# Altium project 006_ARDUNIO.PrjPcb
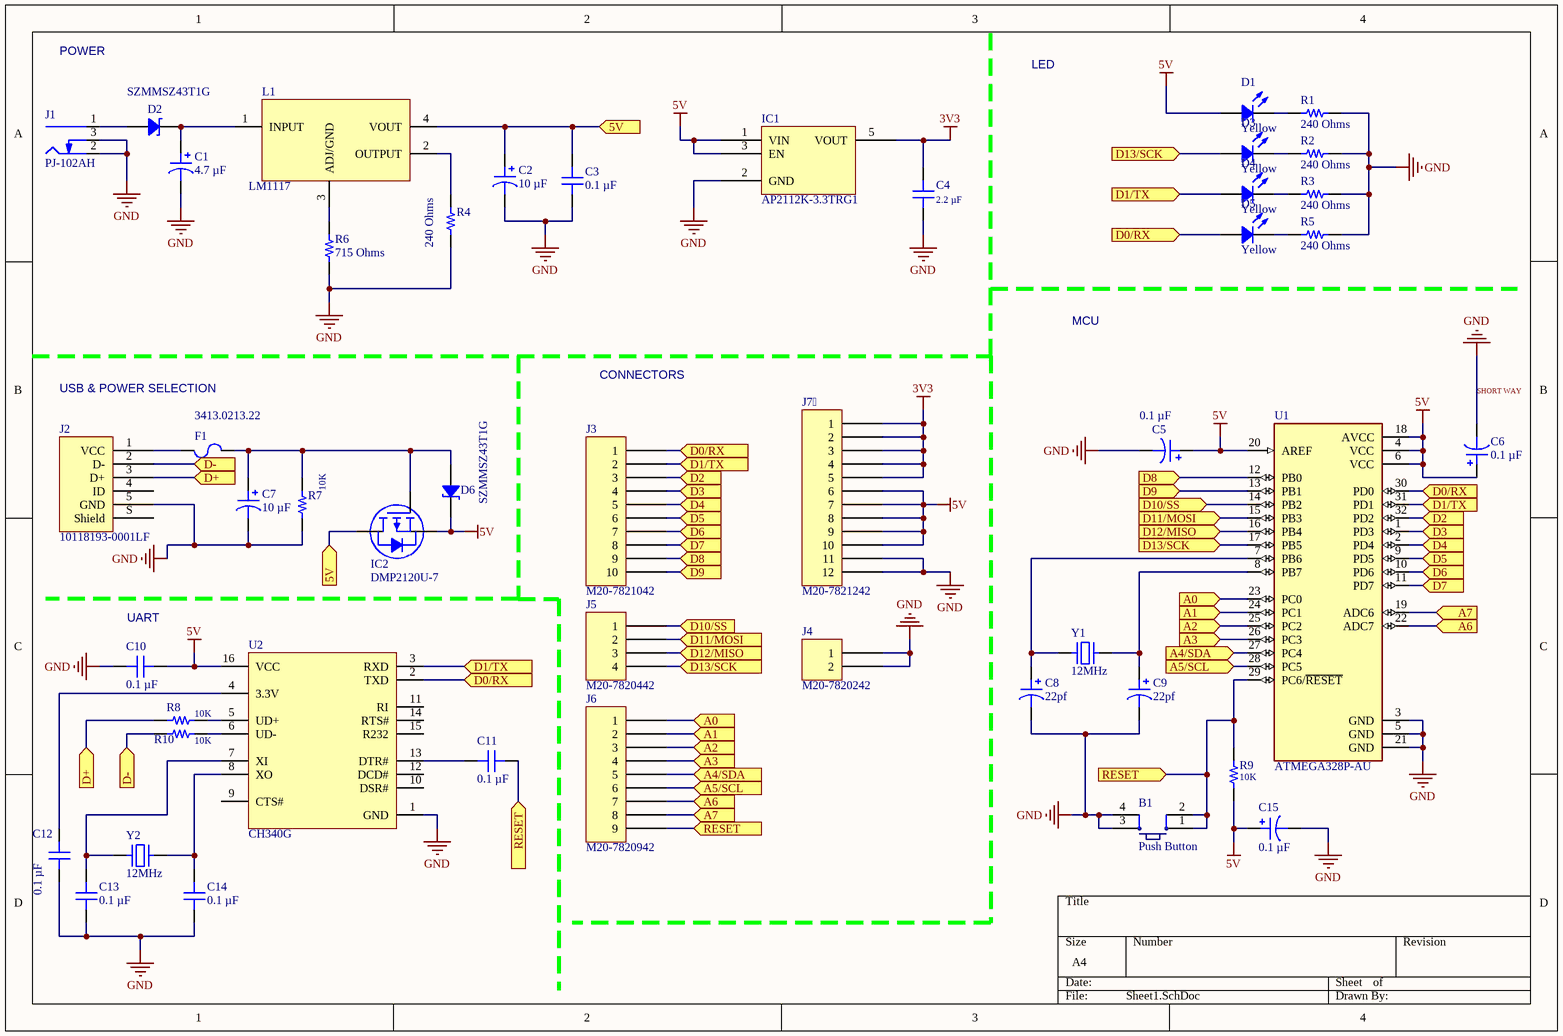
[diagram p0: Sheet1.SchDoc]
1 sheet, 47 parts. Net scope: flat (ports and power ports of the same name join across sheets).
Board file: PCB1.PcbDoc

## Sheet Sheet1.SchDoc
size A4; SheetNumber: 1; SheetTotal: 1

### Parts
B1  Push Button  [PUSB BUTTON-SMD]
C1  4.7 µF  [CAP POL 1206_3216]
C2  10 µF  [CAP POL 1206_3216]
C3  0.1 µF  [CAP 0805_2012]
C4  2.2 µF  [CAP 0805_2012]
C5  0.1 µF  [CAP POL 1206_3216]
C6  0.1 µF  [CAP POL 1206_3216]
C7  10 µF  [CAP POL 1206_3216]
C8  22pf  [CAP POL 1206_3216]
C9  22pf  [CAP POL 1206_3216]
C10  0.1 µF  [CAP 0805_2012]
C11  0.1 µF  [CAP 0805_2012]
C12  0.1 µF  [CAP 0805_2012]
C13  0.1 µF  [CAP 0805_2012]
C14  0.1 µF  [CAP 0805_2012]
C15  0.1 µF  [CAP POL 1206_3216]
D1  Yellow  [LED 0805_2012 YELLOW]
D2  SZMMSZ43T1G  [SOD-123]
D3  Yellow  [LED 0805_2012 YELLOW]
D4  Yellow  [LED 0805_2012 YELLOW]
D5  Yellow  [LED 0805_2012 YELLOW]
D6  SZMMSZ43T1G  [SOD-123]
F1  3413.0213.22  [FUSE 1206_3216 0.6MM]
IC1  AP2112K-3.3TRG1  [DIODES SOT-23-5 W5]
IC2  DMP2120U-7  [DIODES SOT-23-3]
J1  PJ-102AH  [CUI PJ-102AH]
J2  10118193-0001LF  [FCI USB 10118193-0001LF]
J3  M20-7821042  [HARWIN M20-7821045]
J4  M20-7820242  [HARWIN M20-7820245]
J5  M20-7820442  [HARWIN M20-7820445]
J6  M20-7820942  [HARWIN M20-7820945]
J7  M20-7821242  [HARWIN M20-7821245]
L1  LM1117  [LM1117_SOT230P700X180-4N]
R1  240 Ohms  [RES 0805_2012]
R2  240 Ohms  [RES 0805_2012]
R3  240 Ohms  [RES 0805_2012]
R4  240 Ohms  [RES 0805_2012]
R5  240 Ohms  [RES 0805_2012]
R6  715 Ohms  [RES 0805_2012]
R7  10K  [RES 0805_2012]
R8  10K  [RES 0805_2012]
R9  10K  [RES 0805_2012]
R10  10K  [RES 0805_2012]
U1  ATMEGA328P-AU  [QFP80P900X900X120-32N]
U2  CH340G  [CH340G]
Y1  12MHz  [TXC 9C]
Y2  12MHz  [TXC 9C]

### Ports
5V (in, see Sheet1[1C]), 5V (in, see Sheet1[2A]), A0 (in, see Sheet1[2C]), A0 (in, see Sheet1[4C]), A1 (in, see Sheet1[2C]), A1 (in, see Sheet1[4C]), A2 (in, see Sheet1[2C]), A2 (in, see Sheet1[4C]), A3 (in, see Sheet1[2C]), A3 (in, see Sheet1[4C]), A4/SDA (in, see Sheet1[2D]), A4/SDA (in, see Sheet1[3C]), A5/SCL (in, see Sheet1[2D]), A5/SCL (in, see Sheet1[3C]), A6 (in, see Sheet1[2D]), A6 (in, see Sheet1[4C]), A7 (in, see Sheet1[2D]), A7 (in, see Sheet1[4C]), D0/RX (in, see Sheet1[2B], Sheet1[2C], Sheet1[3A]), D0/RX (in, see Sheet1[2B], Sheet1[2C], Sheet1[4B]), D0/RX (in, see Sheet1[2B], Sheet1[3A], Sheet1[4B]), D0/RX (in, see Sheet1[2C], Sheet1[3A], Sheet1[4B]), D1/TX (in, see Sheet1[2B], Sheet1[2C], Sheet1[3A]), D1/TX (in, see Sheet1[2B], Sheet1[2C], Sheet1[4B]), D1/TX (in, see Sheet1[2B], Sheet1[3A], Sheet1[4B]), D1/TX (in, see Sheet1[2C], Sheet1[3A], Sheet1[4B]), D2 (in, see Sheet1[2B]), D2 (in, see Sheet1[4C]), D3 (in, see Sheet1[2B]), D3 (in, see Sheet1[4C]), D4 (in, see Sheet1[2B]), D4 (in, see Sheet1[4C]), D5 (in, see Sheet1[2C]), D5 (in, see Sheet1[4C]), D6 (in, see Sheet1[2C]), D6 (in, see Sheet1[4C]), D7 (in, see Sheet1[2C]), D7 (in, see Sheet1[4C]), D8 (in, see Sheet1[2C]), D8 (in, see Sheet1[3B]), D9 (in, see Sheet1[2C]), D9 (in, see Sheet1[3B]), D10/SS (in, see Sheet1[2C]), D10/SS (in, see Sheet1[3B]), D11/MOSI (in, see Sheet1[2C]), D11/MOSI (in, see Sheet1[3C]), D12/MISO (in, see Sheet1[2C]), D12/MISO (in, see Sheet1[3C]), D13/SCK (in, see Sheet1[2C], Sheet1[3A]), D13/SCK (in, see Sheet1[2C], Sheet1[3C]), D13/SCK (in, see Sheet1[3A], Sheet1[3C]), D+ (in, see Sheet1[1B]), D+ (in, see Sheet1[1D]), D- (in, see Sheet1[1B]), D- (in, see Sheet1[1D]), RESET (in, see Sheet1[2D]), RESET (in, see Sheet1[2D], Sheet1[3D])

### Nets
3V3: C4.2 IC1.5(VOUT) J7.1 J7.2 J7.3 J7.4 J7.5
5V: C5.1 C6.1 C10.1 C15.1 D1.1 D6.2 IC1.1(VIN) IC1.3(EN) IC2.2(S) J7.6 J7.7 J7.8 J7.9 J7.10 R9.2 U1.4(VCC) U1.6(VCC) U1.18(AVCC) U1.20(AREF) U2.16(VCC)
SHORT WAY: B1.3 B1.4 C1.2 C2.2 C3.1 C4.1 C5.2 C6.2 C7.2 C8.2 C9.2 C10.2 C12.1 C13.2 C14.2 C15.2 IC1.2(GND) J1.2(Outer) J1.3(SW) J2.5(GND) J4.1 J4.2 J7.11 J7.12 R1.1 R2.1 R3.1 R4.1 R5.1 R6.1 R7.1 U1.3(GND) U1.5(GND) U1.21(GND) U2.1(GND)  [also labelled GND]
NetB1_1: B1.1 B1.2 C11.1 J6.9 R9.1 U1.29(PC6/~{RESET}) ; port RESET
NetC1_1: C1.1 D2.2 L1.1(INPUT)
NetC2_1: C2.1 C3.2 IC2.3(D) L1.4(VOUT) ; port 5V
NetC7_1: C7.1 D6.1 F1.1 IC2.1(G) R7.2
NetC8_1: C8.1 U1.7(PB6) Y1.1
NetC9_1: C9.1 U1.8(PB7) Y1.2
NetC11_2: C11.2 U2.13(DTR#)
NetC12_2: C12.2 U2.4(3.3V)
NetC13_1: C13.1 U2.7(XI) Y2.1
NetC14_1: C14.1 U2.8(XO) Y2.2
NetD1_2: D1.2 R1.2
NetD2_1: D2.1 J1.1(Centre)
NetD3_1: D3.1 J5.4 U1.17(PB5) ; port D13/SCK
NetD3_2: D3.2 R2.2
NetD4_1: D4.1 J3.2 U1.31(PD1) U2.3(RXD) ; port D1/TX
NetD4_2: D4.2 R3.2
NetD5_1: D5.1 J3.1 U1.30(PD0) U2.2(TXD) ; port D0/RX
NetD5_2: D5.2 R5.2
NetF1_2: F1.2 J2.1(VCC)
NetJ2_2: J2.2(D-) R10.2 ; port D-
NetJ2_3: J2.3(D+) R8.2 ; port D+
NetJ3_3: J3.3 U1.32(PD2) ; port D2
NetJ3_4: J3.4 U1.1(PD3) ; port D3
NetJ3_5: J3.5 U1.2(PD4) ; port D4
NetJ3_6: J3.6 U1.9(PD5) ; port D5
NetJ3_7: J3.7 U1.10(PD6) ; port D6
NetJ3_8: J3.8 U1.11(PD7) ; port D7
NetJ3_9: J3.9 U1.12(PB0) ; port D8
NetJ3_10: J3.10 U1.13(PB1) ; port D9
NetJ5_1: J5.1 U1.14(PB2) ; port D10/SS
NetJ5_2: J5.2 U1.15(PB3) ; port D11/MOSI
NetJ5_3: J5.3 U1.16(PB4) ; port D12/MISO
NetJ6_1: J6.1 U1.23(PC0) ; port A0
NetJ6_2: J6.2 U1.24(PC1) ; port A1
NetJ6_3: J6.3 U1.25(PC2) ; port A2
NetJ6_4: J6.4 U1.26(PC3) ; port A3
NetJ6_5: J6.5 U1.27(PC4) ; port A4/SDA
NetJ6_6: J6.6 U1.28(PC5) ; port A5/SCL
NetJ6_7: J6.7 U1.22(ADC7) ; port A6
NetJ6_8: J6.8 U1.19(ADC6) ; port A7
NetL1_2: L1.2(OUTPUT) R4.2
NetL1_3: L1.3(ADJ/GND) R6.2
NetR8_1: R8.1 U2.5(UD+)
NetR10_1: R10.1 U2.6(UD-)

Not connected (* = marked no-connect by the designer): J2 4(ID) S(Shield); U2 9(CTS#) 10(DSR#) 11(RI) 12(DCD#) 14(RTS#) 15(R232)

### Notes on the sheet
- POWER
- LED
- CONNECTORS
- MCU
- USB & POWER SELECTION
- (near C10) UART

### Library data of the parts
B1 = Push Button: Smd Push Button; Satın Alma Linki: https://urun.n11.com/diger/mini-pushbutton-switch-smd-P227461537?gclid=Cj0KCQjwkoDmBRCcARIsAG3xzl8Y_-jeD7HocNM6lvuZ_rVp83568XPGtNzlPwXWLph8oCRqo0yh87UaApZYEALw_wcB&gclsrc=aw.ds
C1 C5 C6 C8 C9 C15 = T494A106K016AT: CAP TANT 10UF 10% 16V 1206; manufacturer: KEMET; Manufacturer Size Code: A; Capacitance: 10 µF; ESR (Equivalent Series Resistance): 3Ohm; Lifetime @ Temp.: 2000 Hrs @ 125°C; Type: Molded; Part Number: T494A106K016AT; componentlink1description: Datasheet; componentlink1url: https://api.kemet.com/component-edge/download/datasheet/T494A106K016AT.pdf; componentlink2description: DigiKey Link; componentlink2url: https://www.digikey.com/en/products/detail/kemet/T494A106K016AT/3724803; Device Package: 1206 (3216 Metric); Features: General Purpose; Height - Seated (Max): 0.071" (1.80mm); lastupdated: 9/19/2022 1:38:10 PM; Lifecycle Status: Active; Minimum Order: 1; Mounting Type: Surface Mount; Operating Temperature: -55°C ~ 125°C; Package / Case: 1206 (3216 Metric); packaging: TapeAndReel; partid: 171; Part Status: Active; price: 0.27; series: T494; Size / Dimension: 0.126" L x 0.063" W (3.20mm x 1.60mm); Supplier 1: DigiKey; Supplier Part Number 1: 399-9756-1-ND; Tolerance: ±10%; Voltage - Rated: 16 V
  C1: Value: 4.7 µF
  C5 C6 C15: Value: 0.1 µF
  C8 C9: Value: 22pf
C2 C7 = T494A106K016AT: CAP TANT 10UF 10% 16V 1206; manufacturer: KEMET; Manufacturer Size Code: A; ESR (Equivalent Series Resistance): 3Ohm; Lifetime @ Temp.: 2000 Hrs @ 125°C; Type: Molded; Part Number: T494A106K016AT; Value: 10 µF; Capacitance: 10 µF; componentlink1description: Datasheet; componentlink1url: https://api.kemet.com/component-edge/download/datasheet/T494A106K016AT.pdf; componentlink2description: DigiKey Link; componentlink2url: https://www.digikey.com/en/products/detail/kemet/T494A106K016AT/3724803; Device Package: 1206 (3216 Metric); Features: General Purpose; Height - Seated (Max): 0.071" (1.80mm); lastupdated: 9/19/2022 1:38:10 PM; Lifecycle Status: Active; Minimum Order: 1; Mounting Type: Surface Mount; Operating Temperature: -55°C ~ 125°C; Package / Case: 1206 (3216 Metric); packaging: TapeAndReel; partid: 171; Part Status: Active; price: 0.27; series: T494; Size / Dimension: 0.126" L x 0.063" W (3.20mm x 1.60mm); Supplier 1: DigiKey; Supplier Part Number 1: 399-9756-1-ND; Tolerance: ±10%; Voltage - Rated: 16 V
C3 C10-C14 = CC0805JRX7R9BB104: CAP CER 0.1UF 50V X7R 0805; manufacturer: Yageo; Tolerance: ±5%; Part Number: CC0805JRX7R9BB104; Value: 0.1 µF; Applications: General Purpose; Capacitance: 0.1 µF; componentlink1description: Datasheet; componentlink1url: https://www.yageo.com/upload/media/product/productsearch/datasheet/mlcc/UPY-GPHC_X7R_6.3V-to-50V_18.pdf; componentlink2description: DigiKey Link; componentlink2url: https://www.digikey.com/en/products/detail/yageo/CC0805JRX7R9BB104/5195265; Device Package: 0805 (2012 Metric); lastupdated: 9/19/2022 1:04:26 PM; Lifecycle Status: Active; Minimum Order: 1; Mounting Type: Surface Mount, MLCC; Operating Temperature: -55°C ~ 125°C; Package / Case: 0805 (2012 Metric); packaging: TapeAndReel; partid: 42886; Part Status: Active; price: 0.02; series: CC; Size / Dimension: 0.079" L x 0.049" W (2.00mm x 1.25mm); Supplier 1: DigiKey; Supplier Part Number 1: 311-1858-1-ND; Temperature Coefficient: X7R; Thickness (Max): 0.037" (0.95mm); Voltage - Rated: 50V
C4 = CC0805JRX7R9BB104: CAP CER 0.1UF 50V X7R 0805; manufacturer: Yageo; Capacitance: 0.1 µF; Tolerance: ±5%; Part Number: CC0805JRX7R9BB104; Value: 2.2 µF; Applications: General Purpose; componentlink1description: Datasheet; componentlink1url: https://www.yageo.com/upload/media/product/productsearch/datasheet/mlcc/UPY-GPHC_X7R_6.3V-to-50V_18.pdf; componentlink2description: DigiKey Link; componentlink2url: https://www.digikey.com/en/products/detail/yageo/CC0805JRX7R9BB104/5195265; Device Package: 0805 (2012 Metric); lastupdated: 9/19/2022 1:04:26 PM; Lifecycle Status: Active; Minimum Order: 1; Mounting Type: Surface Mount, MLCC; Operating Temperature: -55°C ~ 125°C; Package / Case: 0805 (2012 Metric); packaging: TapeAndReel; partid: 42886; Part Status: Active; price: 0.02; series: CC; Size / Dimension: 0.079" L x 0.049" W (2.00mm x 1.25mm); Supplier 1: DigiKey; Supplier Part Number 1: 311-1858-1-ND; Temperature Coefficient: X7R; Thickness (Max): 0.037" (0.95mm); Voltage - Rated: 50V
D1 D3-D5 = XZMYK54W-4: 2.0X1.2MM YELLOW SMD 0805 LED; Manufacturer: SunLED; Current - Test: 20mA; Lens Color: Colorless; Lens Size: 1.30mm x 1.25mm; Lens Style: Rectangle with Flat Top; Lens Transparency: Clear; Millicandela Rating: 148mcd; Viewing Angle: 140°; Voltage - Forward (Vf) (Typ): 2V; Wavelength - Dominant: 590nm; Part Number: XZMYK54W-4; Color: Yellow; ComponentLink1Description: Datasheet; ComponentLink1URL: https://www.sunledusa.com/products/spec/XZMYK54W-4.pdf; ComponentLink2Description: DigiKey Link; ComponentLink2URL: https://www.digikey.com/en/products/detail/sunled/XZMYK54W-4/13559632; Device Package: 0805 (2012 Metric); Height (Max): 0.50mm; LastUpdated: 9/19/2022 1:51:12 PM; Lifecycle Status: Active; Minimum Order: 1; Mounting Type: Surface Mount; Package / Case: 0805 (2012 Metric); Packaging: TapeAndReel; PartId: 1049; Part Status: Active; Price: 0.05; Series: -; Size / Dimension: 2.00mm L x 1.25mm W; Supplier 1: DigiKey; Supplier Part Number 1: 1497-XZMYK54W-4CT-ND; Supplier Device Package: 0805; Value: Yellow; Wavelength - Peak: 590nm
D2 D6 = SZMMSZ43T1G: DIODE ZENER 43V 500MW SOD123; Manufacturer: ON Semiconductor; Current - Reverse Leakage @ Vr: 50nA @ 30.1V; Impedance (Max) (Zzt): 150 Ohms; Tolerance: ±5%; Voltage - Forward (Vf) (Max) @ If: 900mV @ 10mA; Part Number: SZMMSZ43T1G; ComponentLink1Description: Datasheet; ComponentLink1URL: http://www.onsemi.com/pub/Collateral/MMSZ2V4T1-D.PDF; ComponentLink2Description: DigiKey Link; ComponentLink2URL: http://digikey.com/product-detail/en/on-semiconductor/SZMMSZ43T1G/SZMMSZ43T1GOSCT-ND/9087913; LastUpdated: 9/19/2022 1:47:10 PM; Lifecycle Status: Active; Minimum Order: 1; Mounting Type: Surface Mount; Operating Temperature: -55°C ~ 150°C; Package / Case: SOD-123; Packaging: CutTape; PartId: 2372; Part Status: Active; Power - Max: 500mW; Price: 0.30; Series: Automotive, AEC-Q101; Supplier 1: DigiKey; Supplier Part Number 1: SZMMSZ43T1GOSCT-ND; Supplier Device Package: SOD-123; Voltage - Zener (Nom) (Vz): 43V
F1 = 3413.0213.22: FUSE BOARD MNT 500MA 32VAC 63VDC; Manufacturer: Schurter Inc.; Approval Agency: cURus, VDE; Breaking Capacity @ Rated Voltage: 63A; Fuse Type: Board Mount (Cartridge Style Excluded); Melting I²t: 0.041; Response Time: Fast Blow; Voltage Rating - AC: 32V; Voltage Rating - DC: 63V; Part Number: 3413.0213.22; Approvals: cURus, VDE; ComponentLink1Description: Datasheet; ComponentLink1URL: https://us.schurter.com/pdf/english/typ_USI_1206.pdf; ComponentLink2Description: DigiKey Link; ComponentLink2URL: http://digikey.com/product-detail/en/schurter-inc/3413.0213.22/486-1141-1-ND/1522973; Current Rating (Amps): 500mA; Device Package: 1206 (3216 Metric); LastUpdated: 9/2/2020 1:30:41 AM; Lifecycle Status: Active; Minimum Order: 1; Mounting Type: Surface Mount; Operating Temperature: -55°C ~ 90°C; Package / Case: 1206 (3216 Metric); Packaging: TapeAndReel; Part Status: Active; Price: 0.26; Series: USI 1206; Size / Dimension: 0.126" L x 0.063" W x 0.024" H (3.20mm x 1.60mm x 0.60mm); Supplier 1: DigiKey; Supplier Part Number 1: 486-1141-1-ND
IC1 = AP2112K-3.3TRG1: IC REG LINEAR 3.3V 600MA SOT25; Manufacturer: Diodes Incorporated; Control Features: Enable; Current - Quiescent (Iq): 80 µA; Number of Regulators: 1; Output Configuration: Positive; Output Type: Fixed; Protection Features: Over Current, Over Temperature; PSRR: 65sB (100Hz ~ 1KHz); Voltage Dropout (Max): 0.4V @ 600mA; Voltage - Input (Max): 6V; Part Number: AP2112K-3.3TRG1; ComponentLink1Description: Datasheet; ComponentLink1URL: https://www.diodes.com/assets/Datasheets/AP2112.pdf; ComponentLink2Description: DigiKey Link; ComponentLink2URL: https://www.digikey.com/en/products/detail/diodes-incorporated/AP2112K-3-3TRG1/4470746; Current - Output: 600mA; LastUpdated: 9/19/2022 2:01:19 PM; Lifecycle Status: Active; Minimum Order: 1; Mounting Type: Surface Mount; Operating Temperature: -40°C ~ 85°C; Package / Case: SC-74A, SOT-753; Packaging: TapeAndReel; Part Status: Active; Price: 0.09; Series: -; Supplier 1: DigiKey; Supplier Part Number 1: AP2112K-3.3TRG1DICT-ND; Supplier Device Package: SOT-25; Voltage - Output (Min/Fixed): 3.3V
IC2 = DMP2120U-7: MOSFET P-CH 20V 3.8A SOT23; Manufacturer: Diodes Incorporated; Current - Continuous Drain (Id) @ 25°C: 3.8A (Ta); Drive Voltage (Max Rds On,  Min Rds On): 1.8V, 4.5V; FET Type: P-Channel; Gate Charge (Qg) (Max) @ Vgs: 6.3 nC @ 4.5 V; Input Capacitance (Ciss) (Max) @ Vds: 487 pF @ 20 V; Power Dissipation (Max): 800mW (Ta); Rds On (Max) @ Id, Vgs: 62mOhm @ 4.2A, 4.5V; Vgs (Max): ±8V; Vgs(th) (Max) @ Id: 1V @ 250µA; Part Number: DMP2120U-7; ComponentLink1Description: Datasheet; ComponentLink1URL: https://www.diodes.com/assets/Datasheets/DMP2120U.pdf; ComponentLink2Description: DigiKey Link; ComponentLink2URL: https://www.digikey.com/en/products/detail/diodes-incorporated/DMP2120U-7/8275357; Drain to Source Voltage (Vdss): 20 V; LastUpdated: 9/19/2022 2:00:15 PM; Lifecycle Status: Active; Minimum Order: 1; Mounting Type: Surface Mount; Operating Temperature: -55°C ~ 150°C (TJ); Package / Case: TO-236-3, SC-59, SOT-23-3; Packaging: TapeAndReel; Part Status: Active; Price: 0.07; Series: -; Supplier 1: DigiKey; Supplier Part Number 1: DMP2120U-7DICT-ND; Supplier Device Package: SOT-23-3; Technology: MOSFET (Metal Oxide)
J1 = PJ-102AH: CONN PWR JACK 2X5.5MM SOLDER; Manufacturer: CUI Devices; Actual Diameter: 0.079" (2.00mm ID), 0.256" (6.50mm OD); Current Rating (Amps): 5A; Gender: Male; Industry Recognized Mating Diameter: 2.00mm ID (0.079"), 5.50mm OD (0.217"); Internal Switch(s): Single Switch, Normally Closed; Material Flammability Rating: UL94 V-0; Mating Length/Depth: 0.354" (9.00mm); Number of Positions/Contacts: 2 Conductors, 3 Contacts; Shielding: Unshielded; Voltage - Rated: 24VDC; Part Number: PJ-102AH; ComponentLink1Description: Datasheet; ComponentLink1URL: https://www.cuidevices.com/product/resource/digikeypdf/pj-102ah.pdf; ComponentLink2Description: DigiKey Link; ComponentLink2URL: //digikey.com/product-detail/en/cui-devices/PJ-102AH/CP-102AH-ND/408448; Connector Type: Jack; LastUpdated: 12/16/2019 7:01:27 PM; Lifecycle Status: 0; Minimum Order: 1; Mounting Type: Through Hole, Right Angle; Packaging: Tray; Part Status: Active; Price: 0.76; Series: -; Supplier 1: DigiKey; Supplier Part Number 1: CP-102AH-ND; Termination: Solder
J2 = 10118193-0001LF: CONN RCPT USB2.0 MICRO B SMD R/A; Manufacturer: Amphenol ICC (FCI); Connector Type: USB - micro B; Current Rating (Amps): 1.8A per Contact; Gender: Receptacle; Mating Cycles: 10000; Number of Contacts: 5; Number of Ports: 1; Shielding: Shielded; Voltage - Rated: 100VAC; Part Number: 10118193-0001LF; ComponentLink1Description: Datasheet; ComponentLink1URL: https://cdn.amphenol-icc.com/media/wysiwyg/files/documentation/datasheet/inputoutput/io_usb_micro.pdf; ComponentLink2Description: DigiKey Link; ComponentLink2URL: //digikey.com/product-detail/en/amphenol-icc-fci/10118193-0001LF/609-4616-2-ND/2785388; Features: Solder Retention; LastUpdated: 12/9/2019 8:51:28 PM; Lifecycle Status: 0; Minimum Order: 1; Mounting Feature: Horizontal; Mounting Type: Surface Mount, Right Angle; Through Hole; Operating Temperature: -30°C ~ 80°C; Packaging: TapeAndReel; Part Status: Active; Price: 0.21; Series: -; Specifications: USB 2.0; Supplier 1: DigiKey; Supplier Part Number 1: 609-4616-2-ND; Termination: Solder
J3 = M20-7821042: CONN RCPT 10POS 0.1 GOLD PCB; Manufacturer: Harwin Inc.; Connector Type: Receptacle; Contact Length - Post: 0.118" (3.00mm); Current Rating (Amps): 3A; Mated Stacking Heights: 11.04mm, 12.63mm; Material Flammability Rating: UL94 V-0; Number of Positions: 10; Number of Positions Loaded: All; Pitch - Mating: 0.100" (2.54mm); Style: Board to Board or Cable; Part Number: M20-7821042; ComponentLink1Description: Datasheet; ComponentLink1URL: https://cdn.harwin.com/pdfs/Harwin_PC_Connectors_M20.pdf; ComponentLink2Description: DigiKey Link; ComponentLink2URL: http://digikey.com/product-detail/en/harwin-inc/M20-7821042/952-1846-ND/3727813; Contact Finish - Mating: Gold; Contact Finish - Post: Tin; Contact Finish Thickness - Mating: Flash; Contact Type: Female Socket; Fastening Type: Push-Pull; Insulation Color: Black; Insulation Height: 0.335" (8.51mm); LastUpdated: 9/21/2022 6:59:03 PM; Lifecycle Status: Active; Minimum Order: 1; Mounting Type: Through Hole; Number of Rows: 1; Operating Temperature: -40°C ~ 105°C; Packaging: Tube; Part Status: Active; Price: 1.39; Series: M20; Supplier 1: DigiKey; Supplier Part Number 1: 952-1846-ND; Termination: Solder
J4 = M20-7820242: CONN RCPT 2POS 0.1 GOLD PCB; Manufacturer: Harwin Inc.; Connector Type: Receptacle; Contact Length - Post: 0.118" (3.00mm); Current Rating (Amps): 3A; Mated Stacking Heights: 11.04mm, 12.63mm; Material Flammability Rating: UL94 V-0; Number of Positions: 2; Number of Positions Loaded: All; Pitch - Mating: 0.100" (2.54mm); Style: Board to Board or Cable; Part Number: M20-7820242; ComponentLink1Description: Datasheet; ComponentLink1URL: https://cdn.harwin.com/pdfs/C001XX_M20_Series_Connectors.pdf; ComponentLink2Description: DigiKey Link; ComponentLink2URL: https://www.digikey.com/en/products/detail/harwin-inc/M20-7820242/3727744; Contact Finish - Mating: Gold; Contact Finish - Post: Tin; Contact Finish Thickness - Mating: Flash; Contact Type: Female Socket; Fastening Type: Push-Pull; Insulation Color: Black; Insulation Height: 0.335" (8.51mm); LastUpdated: 9/21/2022 6:53:47 PM; Lifecycle Status: Active; Minimum Order: 1; Mounting Type: Through Hole; Number of Rows: 1; Operating Temperature: -40°C ~ 105°C; Packaging: Tube; Part Status: Active; Price: 0.38; Series: M20; Supplier 1: DigiKey; Supplier Part Number 1: 952-1775-ND; Termination: Solder
J5 = M20-7820442: CONN RCPT 4POS 0.1 GOLD PCB; Manufacturer: Harwin Inc.; Connector Type: Receptacle; Contact Length - Post: 0.118" (3.00mm); Current Rating (Amps): 3A; Mated Stacking Heights: 11.04mm, 12.63mm; Material Flammability Rating: UL94 V-0; Number of Positions: 4; Number of Positions Loaded: All; Pitch - Mating: 0.100" (2.54mm); Style: Board to Board or Cable; Part Number: M20-7820442; ComponentLink1Description: Datasheet; ComponentLink1URL: https://cdn.harwin.com/pdfs/Harwin_PC_Connectors_M20.pdf; ComponentLink2Description: DigiKey Link; ComponentLink2URL: https://www.digikey.com/en/products/detail/harwin-inc/M20-7820442/3727760; Contact Finish - Mating: Gold; Contact Finish - Post: Tin; Contact Finish Thickness - Mating: Flash; Contact Type: Female Socket; Fastening Type: Push-Pull; Insulation Color: Black; Insulation Height: 0.335" (8.51mm); LastUpdated: 9/21/2022 6:57:11 PM; Lifecycle Status: Active; Minimum Order: 1; Mounting Type: Through Hole; Number of Rows: 1; Operating Temperature: -40°C ~ 105°C; Packaging: Tube; Part Status: Active; Price: 0.45; Series: M20; Supplier 1: DigiKey; Supplier Part Number 1: 952-1791-ND; Termination: Solder
J6 = M20-7820942: CONN RCPT 9POS 0.1 GOLD PCB; Manufacturer: Harwin Inc.; Connector Type: Receptacle; Current Rating (Amps): 3A; Mated Stacking Heights: 11.04mm, 12.63mm; Material Flammability Rating: UL94 V-0; Number of Positions: 9; Number of Positions Loaded: All; Style: Board to Board or Cable; Part Number: M20-7820942; ComponentLink1Description: Datasheet; ComponentLink1URL: https://cdn.harwin.com/pdfs/C001XX_M20_Series_Connectors.pdf; ComponentLink2Description: DigiKey Link; ComponentLink2URL: http://digikey.com/product-detail/en/harwin-inc/M20-7820942/M20-7820942-ND/3919444; Contact Finish - Mating: Gold; Contact Finish - Post: Tin; Contact Finish Thickness - Mating: Flash; Contact Type: Female Socket; Fastening Type: Push-Pull; Insulation Color: Black; LastUpdated: 9/21/2022 6:58:48 PM; Lifecycle Status: Active; Minimum Order: 5016; Mounting Type: Through Hole; Number of Rows: 1; Operating Temperature: -40°C ~ 105°C; Packaging: Tube; Part Status: Active; Price: 0.59; Series: M20; Supplier 1: DigiKey; Supplier Part Number 1: M20-7820942-ND; Termination: Solder
J7 = M20-7821242: CONN RCPT 12POS 0.1 GOLD PCB; Manufacturer: Harwin Inc.; Connector Type: Receptacle; Current Rating (Amps): 3A; Mated Stacking Heights: 11.04mm, 12.63mm; Material Flammability Rating: UL94 V-0; Number of Positions: 12; Number of Positions Loaded: All; Style: Board to Board or Cable; Part Number: M20-7821242; ComponentLink1Description: Datasheet; ComponentLink1URL: https://cdn.harwin.com/pdfs/C001XX_M20_Series_Connectors.pdf; ComponentLink2Description: DigiKey Link; ComponentLink2URL: http://digikey.com/product-detail/en/harwin-inc/M20-7821242/952-1852-ND/3727819; Contact Finish - Mating: Gold; Contact Finish - Post: Tin; Contact Finish Thickness - Mating: Flash; Contact Type: Female Socket; Fastening Type: Push-Pull; Insulation Color: Black; LastUpdated: 9/21/2022 6:59:31 PM; Lifecycle Status: Active; Minimum Order: 5004; Mounting Type: Through Hole; Number of Rows: 1; Operating Temperature: -40°C ~ 105°C; Packaging: Tube; Part Status: Active; Price: 0.74; Series: M20; Supplier 1: DigiKey; Supplier Part Number 1: 952-1852-ND; Termination: Solder
L1 = LM1117: LM1117 voltaj regulator
R1-R10 = ERJ-6ENF3001V: RES SMD 3K OHM 1% 1/8W 0805; Manufacturer: Panasonic Electronic Components; Power (Watts): 0.125W, 1/8W; Resistance: 3 kOhms; Temperature Coefficient: ±100ppm/°C; Part Number: ERJ-6ENF3001V; ComponentLink1Description: Datasheet; ComponentLink1URL: https://industrial.panasonic.com/cdbs/www-data/pdf/RDA0000/AOA0000C304.pdf; ComponentLink2Description: DigiKey Link; ComponentLink2URL: https://www.digikey.com/en/products/detail/panasonic-electronic-components/ERJ-6ENF3001V/366038; Composition: Thick Film; Device Package: 0805 (2012 Metric); Features: Automotive AEC-Q200; Height - Seated (Max): 0.028" (0.70mm); LastUpdated: 9/19/2022 1:36:50 PM; Lifecycle Status: Active; Minimum Order: 1; Number of Terminations: 2; Operating Temperature: -55°C ~ 155°C; Package / Case: 0805 (2012 Metric); Packaging: TapeAndReel; PartId: 30109; Part Status: Active; Price: 0.01; Ratings: AEC-Q200; Series: ERJ-6EN; Size / Dimension: 0.079" L x 0.049" W (2.00mm x 1.25mm); Supplier 1: DigiKey; Supplier Part Number 1: P3.0KCCT-ND; Supplier Device Package: 0805; Tolerance: ±1%
  R1-R5: Value: 240 Ohms
  R6: Value: 715 Ohms
  R7-R10: Value: 10K
U1 = ATMEGA328P-AU: ATmega Series 20 MHz 32 KB Flash 2 KB SRAM 8-Bit Microcontroller - TQFP-32; Value: *; Availability: Unavailable; Price: None; Package: None; MP: ATMEGA328P-AU
U2 = CH340G: CH320G ,USB_TO_TTL CONVERTER
Y1 Y2 = 9C-12.000MAAJ-T: CRYSTAL 12.0000MHZ 18PF SMD; Manufacturer: TXC CORPORATION; ESR (Equivalent Series Resistance): 40 Ohms; Frequency Stability: ±30ppm; Operating Mode: Fundamental; Part Number: 9C-12.000MAAJ-T; ComponentLink1Description: Datasheet; ComponentLink1URL: http://www.txccorp.com/download/products/quartz_crystals/2015TXC_9C_32.pdf; ComponentLink2Description: DigiKey Link; ComponentLink2URL: http://digikey.com/product-detail/en/txc-corporation/9C-12.000MAAJ-T/887-1053-1-ND/2118930; Frequency: 12MHz; Frequency Tolerance: ±30ppm; Height - Seated (Max): 0.161" (4.10mm); LastUpdated: 9/19/2022 1:51:59 PM; Lifecycle Status: Active; Load Capacitance: 18pF; Minimum Order: 1; Mounting Type: Surface Mount; Operating Temperature: -20°C ~ 70°C; Package / Case: HC-49/US; Packaging: TapeAndReel; PartId: 707; Part Status: Active; Price: 0.22; Series: 9C; Size / Dimension: 0.449" L x 0.189" W (11.40mm x 4.80mm); Supplier 1: DigiKey; Supplier Part Number 1: 887-1053-1-ND; Type: MHz Crystal; Value: 12MHz